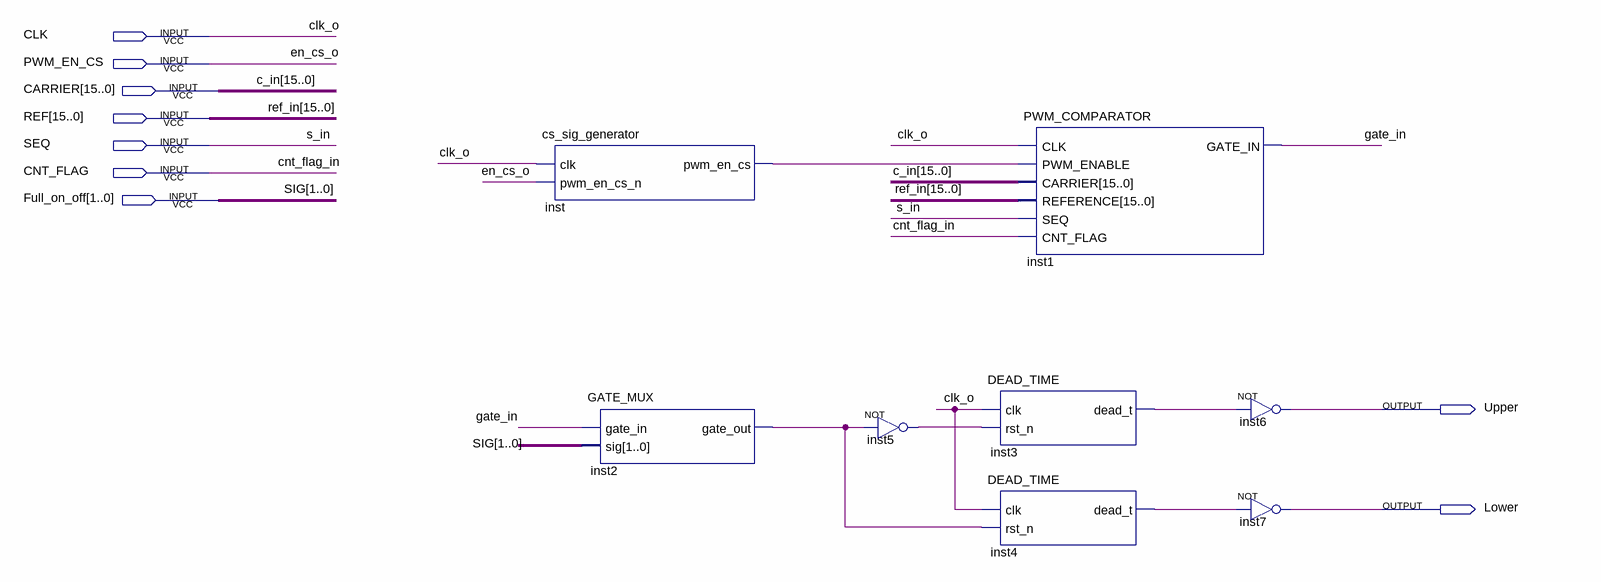
[diagram p0: schematic sheet]
// Quartus schematic PWM.bdf as structural Verilog: 8 symbols, 9 pins
module PWM (
  input  CLK,
  input  PWM_EN_CS,
  input  [15:0] CARRIER,
  input  [15:0] REF,
  input  SEQ,
  input  CNT_FLAG,
  input  [1:0] Full_on_off,
  output Upper,
  output Lower
);

  wire gate_in, inst2_gate_out, inst3_dead_t, inst4_dead_t, inst5_out, inst_pwm_en_cs;

  cs_sig_generator inst (.clk(CLK), .pwm_en_cs_n(PWM_EN_CS), .pwm_en_cs(inst_pwm_en_cs));
  GATE_MUX inst2 (.gate_in(gate_in), .sig(Full_on_off), .gate_out(inst2_gate_out));
  not inst5 (inst5_out, inst2_gate_out);
  PWM_COMPARATOR inst1 (
    .CLK(CLK), .PWM_ENABLE(inst_pwm_en_cs), .CARRIER(CARRIER), .REFERENCE(REF), .SEQ(SEQ),
    .CNT_FLAG(CNT_FLAG), .GATE_IN(gate_in));
  DEAD_TIME inst3 (.clk(CLK), .rst_n(inst5_out), .dead_t(inst3_dead_t));
  DEAD_TIME inst4 (.clk(CLK), .rst_n(inst2_gate_out), .dead_t(inst4_dead_t));
  not inst6 (Upper, inst3_dead_t);
  not inst7 (Lower, inst4_dead_t);

  // Other names for the same wires on the sheet: c_in[15:0] = CARRIER; clk_o = CLK; cnt_flag_in = CNT_FLAG;
  //   en_cs_o = PWM_EN_CS; ref_in[15:0] = REF; s_in = SEQ; SIG[1:0] = Full_on_off
endmodule
